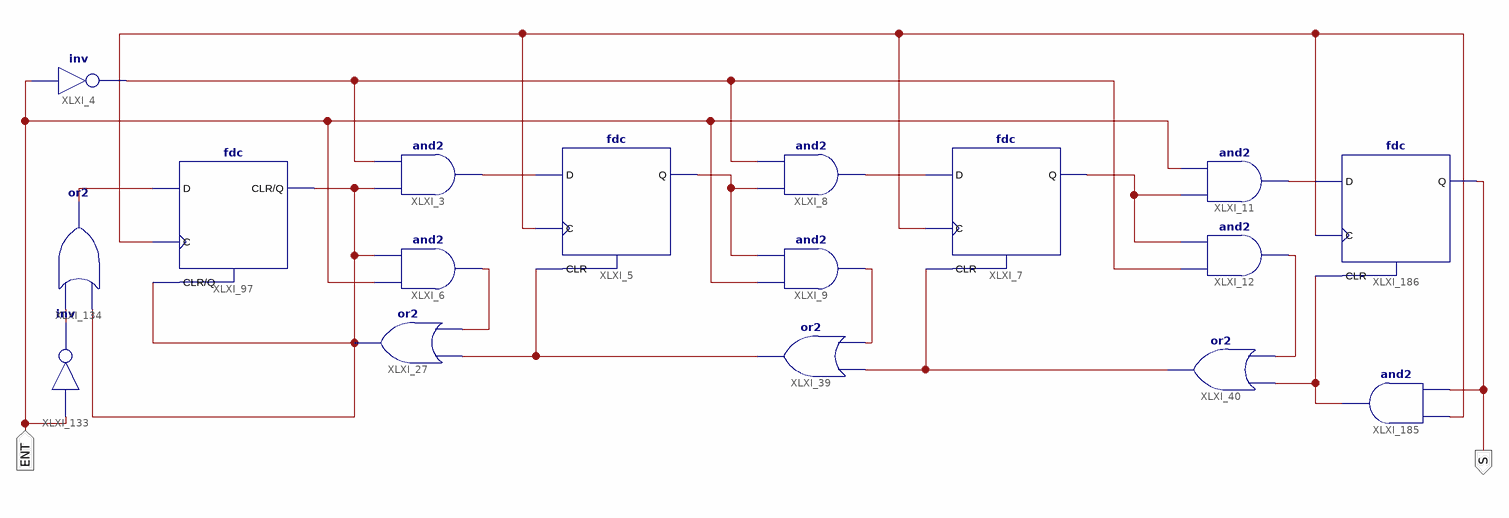
[diagram p0: schematic sheet 1]
// Xilinx ISE schematic Maq_Estados.sch (spartan3) as structural Verilog: 17 symbols, 2 ports
module Maq_Estados (
  input  ENT,
  output S
);

  wire XLXN_4, XLXN_5, XLXN_12, XLXN_14, XLXN_15, XLXN_19, XLXN_20, XLXN_21, XLXN_22, XLXN_23, XLXN_38,
       XLXN_39, XLXN_41, XLXN_113, XLXN_135, XLXN_207;

  and XLXI_3 (XLXN_5, XLXN_14, XLXN_4);
  fdc XLXI_5 (.C(XLXN_207), .CLR(XLXN_19), .D(XLXN_5), .Q(XLXN_12));
  and XLXI_9 (XLXN_20, ENT, XLXN_12);
  and XLXI_6 (XLXN_15, ENT, XLXN_14);
  and XLXI_8 (XLXN_38, XLXN_12, XLXN_4);
  or XLXI_27 (XLXN_14, XLXN_15, XLXN_19);
  fdc XLXI_7 (.C(XLXN_207), .CLR(XLXN_21), .D(XLXN_38), .Q(XLXN_39));
  and XLXI_11 (XLXN_41, XLXN_39, ENT);
  and XLXI_12 (XLXN_22, XLXN_4, XLXN_39);
  or XLXI_39 (XLXN_19, XLXN_20, XLXN_21);
  or XLXI_40 (XLXN_21, XLXN_22, XLXN_23);
  fdc XLXI_97 (.C(XLXN_207), .CLR(XLXN_14), .D(XLXN_113), .Q(XLXN_14));
  not XLXI_4 (XLXN_4, ENT);
  not XLXI_133 (XLXN_135, ENT);
  or XLXI_134 (XLXN_113, XLXN_14, XLXN_135);
  and XLXI_185 (XLXN_23, S, XLXN_207);
  fdc XLXI_186 (.C(XLXN_207), .CLR(XLXN_23), .D(XLXN_41), .Q(S));
endmodule
